# EAGLE design phasor (EAGLE 6.2)
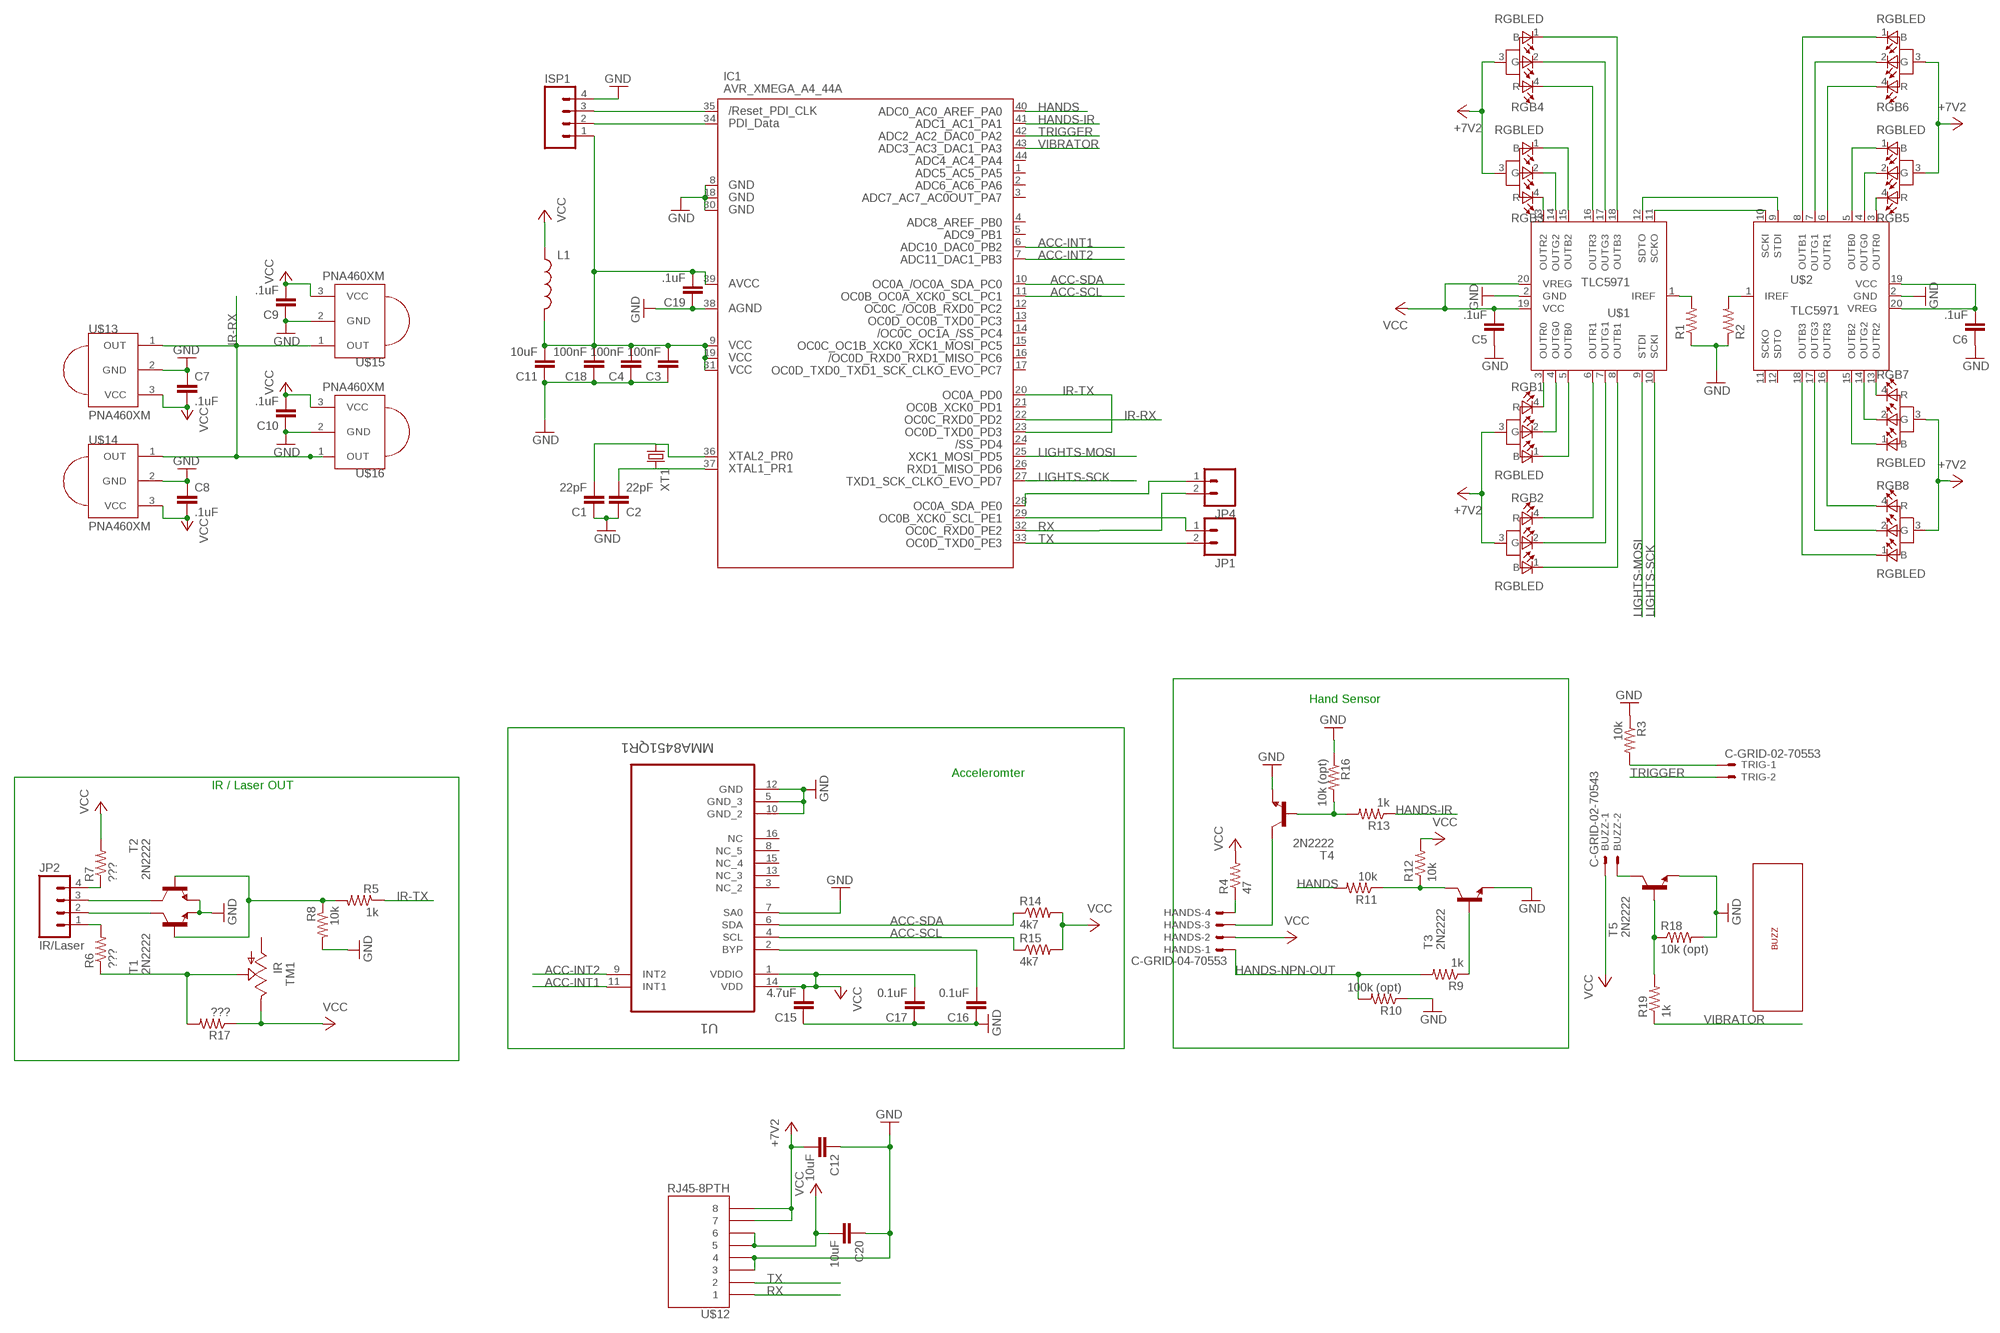
[diagram p0: schematic, sheet 1]

## Parts
BUZZ  C-GRID-02-70543  [70543-02]
C1  22pF  CAPPTH  [CAP-PTH-SMALL]
C2  22pF  CAPPTH  [CAP-PTH-SMALL]
C3  100nF  CAP0603-CAP  [0603-CAP]
C4  100nF  CAP0603-CAP  [0603-CAP]
C5  .1uF  CAPPTH  [CAP-PTH-SMALL]
C6  .1uF  CAPPTH  [CAP-PTH-SMALL]
C7  .1uF  CAPPTH  [CAP-PTH-SMALL]
C8  .1uF  CAPPTH  [CAP-PTH-SMALL]
C9  .1uF  CAPPTH  [CAP-PTH-SMALL]
C10  .1uF  CAPPTH  [CAP-PTH-SMALL]
C11  10uF  CAP1206  [1206]
C12  10uF  CAP1206  [1206]
C15  4.7uF  CAP0805  [0805]
C16  0.1uF  CAP0603-CAP  [0603-CAP]
C17  0.1uF  CAP0603-CAP  [0603-CAP]
C18  100nF  CAP0603-CAP  [0603-CAP]
C19  .1uF  CAP0603-CAP  [0603-CAP]
C20  10uF  CAP1206  [1206]
HANDS  C-GRID-04-70553  [70553-04]
IC1  AVR_XMEGA_A4_44A  [TQFP44]
ISP1  M04LOCK  [1X04_LOCK]
JP1  M02PTH  [1X02]
JP2  IR/Laser  M04LOCK  [1X04_LOCK]
JP4  M02PTH  [1X02]
L1  INDUCTOR1206H*  [1206]
R1  R-US_0204/7  [0204/7]
R2  R-US_0204/7  [0204/7]
R3  10k  R-US_0204/7  [0204/7]
R4  47  R-US_0204/7  [0204/7]
R5  1k  R-US_0204/7  [0204/7]
R6  ???  R-US_0204/7  [0204/7]
R7  ???  R-US_0204/7  [0204/7]
R8  10k  R-US_0204/7  [0204/7]
R9  1k  R-US_0204/7  [0204/7]
R10  100k (opt)  R-US_0204/7  [0204/7]
R11  10k  R-US_0204/7  [0204/7]
R12  10k  R-US_0204/7  [0204/7]
R13  1k  R-US_0204/7  [0204/7]
R14  4k7  R-US_0204/7  [0204/7]
R15  4k7  R-US_0204/7  [0204/7]
R16  10k (opt)  R-US_0204/7  [0204/7]
R17  ???  R-US_0204/7  [0204/7]
R18  10k (opt)  R-US_0204/7  [0204/7]
R19  1k  R-US_0204/7  [0204/7]
RGB1  RGBLED  [RGB-LED-10MM-COMMON-ANODE]
RGB2  RGBLED  [RGB-LED-10MM-COMMON-ANODE]
RGB3  RGBLED  [RGB-LED-10MM-COMMON-ANODE]
RGB4  RGBLED  [RGB-LED-10MM-COMMON-ANODE]
RGB5  RGBLED  [RGB-LED-10MM-COMMON-ANODE]
RGB6  RGBLED  [RGB-LED-10MM-COMMON-ANODE]
RGB7  RGBLED  [RGB-LED-10MM-COMMON-ANODE]
RGB8  RGBLED  [RGB-LED-10MM-COMMON-ANODE]
T1  2N2222  [TO92-EBC-OVAL]
T2  2N2222  [TO92-EBC-OVAL]
T3  2N2222  [TO92-EBC-OVAL]
T4  2N2222  [TO92-EBC-OVAL]
T5  2N2222  [TO92-EBC-OVAL]
TM1  IR  TRIM_US-B25P  [B25P]
TRIG  C-GRID-02-70553  [70553-02]
U1  MMA8451QR1  [QFN50P300X300X100-16N]
U$1  TLC5971  [SSOP20]
U$2  TLC5971  [SSOP20]
U$3  VIB-CAPSULE  [VIB-CAPSULE]
U$12  RJ45-8PTH  [RJ45-8]
U$13  PNA460XM  [PNA460XM]
U$14  PNA460XM  [PNA460XM]
U$15  PNA460XM  [PNA460XM]
U$16  PNA460XM  [PNA460XM]
XT1  CRYSTALHC49US  [HC49US]

## Nets
+7V2: C12.2 RGB1.3(VCC) RGB2.3(VCC) RGB3.3(VCC) RGB4.3(VCC) RGB5.3(VCC) RGB6.3(VCC) RGB7.3(VCC) RGB8.3(VCC) U$12.7 U$12.8
ACC-INT1: IC1.6(PB2) U1.11(INT1)
ACC-INT2: IC1.7(PB3) U1.9(INT2)
ACC-SCL: IC1.11(PC1) R15.1 U1.4(SCL)
ACC-SDA: IC1.10(PC0) R14.1 U1.6(SDA)
GND: C1.1 C2.1 C3.1 C4.1 C5.1 C6.1 C7.1 C8.1 C9.1 C10.1 C11.1 C12.1 C15.1 C16.1 C17.1 C18.1 C19.1 C20.1 IC1.8(GND1) IC1.18(GND2) IC1.30(GND3) IC1.38(AGND) ISP1.4 R1.1 R2.1 R3.1 R8.2 R10.1 R16.1 R18.2 T1.E T2.E T3.E T4.E T5.E U1.5(GND_3) U1.7(SA0) U1.10(GND_2) U1.12(GND) U$1.2(GND) U$2.2(GND) U$12.3 U$12.4 U$13.2(GND) U$14.2(GND) U$15.2(GND) U$16.2(GND)
HANDS: IC1.40(PA0) R11.2
HANDS-IR: IC1.41(PA1) R13.1
HANDS-NPN-OUT: HANDS.1 R9.2 R10.2
IR-RX: IC1.22(PD2) U$13.1(OUT) U$14.1(OUT) U$15.1(OUT) U$16.1(OUT)
IR-TX: IC1.20(PD0) IC1.23(PD3) R5.1
LIGHTS-MOSI: IC1.25(PD5) U$1.9(STDI)
LIGHTS-SCK: IC1.27(PD7) U$1.10(SCKI)
N$1: U$1.11(SCKO) U$2.10(SCKI)
N$2: U$1.12(SDTO) U$2.9(STDI)
N$3: R1.2 U$1.1(IREF)
N$4: RGB1.4(R) U$1.3(OUTR0)
N$5: RGB1.2(G) U$1.4(OUTG0)
N$6: RGB1.1(B) U$1.5(OUTB0)
N$7: RGB2.4(R) U$1.6(OUTR1)
N$8: RGB2.2(G) U$1.7(OUTG1)
N$9: RGB2.1(B) U$1.8(OUTB1)
N$10: RGB3.1(B) U$1.15(OUTB2)
N$11: RGB3.4(R) U$1.13(OUTR2)
N$12: IC1.29(PE1) JP1.1
N$13: RGB4.4(R) U$1.16(OUTR3)
N$14: BUZZ.2 T5.C
N$15: RGB4.1(B) U$1.18(OUTB3)
N$16: RGB5.4(R) U$2.3(OUTR0)
N$17: RGB5.2(G) U$2.4(OUTG0)
N$18: RGB5.1(B) U$2.5(OUTB0)
N$19: R18.1 R19.2 T5.B
N$20: RGB6.2(G) U$2.7(OUTG1)
N$21: RGB6.1(B) U$2.8(OUTB1)
N$22: RGB8.4(R) U$2.16(OUTR3)
N$23: RGB8.2(G) U$2.17(OUTG3)
N$24: RGB8.1(B) U$2.18(OUTB3)
N$25: RGB7.1(B) U$2.15(OUTB2)
N$26: RGB7.2(G) U$2.14(OUTG2)
N$27: RGB7.4(R) U$2.13(OUTR2)
N$28: C2.2 IC1.37(PR1) XT1.2
N$29: C1.2 IC1.36(PR0) XT1.1
N$30: R3.2 TRIG.1
N$31: R6.1 R17.2 TM1.S
N$32: HANDS.4 R4.1
N$33: R9.1 T3.B
N$34: R11.1 R12.1 T3.C
N$35: R2.2 U$2.1(IREF)
N$36: C16.2 U1.2(BYP)
N$37: HANDS.3 T4.C
N$38: JP2.1 R6.2
N$39: JP2.2 T1.C
N$40: JP2.4 R7.1
N$41: JP2.3 T2.C
N$42: R5.2 R8.1 T1.B T2.B
N$43: IC1.28(PE0) JP4.1
N$44: IC1.34(PDI_DATA) ISP1.2
N$45: R13.2 R16.2 T4.B
N$46: IC1.35(RESET) ISP1.3
N$50: C3.2 C4.2 C11.2 C18.2 C19.2 IC1.9(VCC1) IC1.19(VCC2) IC1.31(VCC3) IC1.39(AVCC) ISP1.1 L1.2
RGB3: RGB3.2(G) U$1.14(OUTG2)
RGB4: RGB4.2(G) U$1.17(OUTG3)
RGB6: RGB6.4(R) U$2.6(OUTR1)
RX: IC1.32(PE2) JP4.2 U$12.1
TRIGGER: IC1.42(PA2) TRIG.2
TX: IC1.33(PE3) JP1.2 U$12.2
VCC: BUZZ.1 C5.2 C6.2 C7.2 C8.2 C9.2 C10.2 C15.2 C17.2 C20.2 HANDS.2 L1.1 R4.2 R7.2 R12.2 R14.2 R15.2 R17.1 TM1.E U1.1(VDDIO) U1.14(VDD) U$1.19(VCC) U$1.20(VREG) U$2.19(VCC) U$2.20(VREG) U$12.5 U$12.6 U$13.3(VCC) U$14.3(VCC) U$15.3(VCC) U$16.3(VCC)
VIBRATOR: IC1.43(PA3) R19.1
Unconnected: IC1.1(PA5) IC1.2(PA6) IC1.3(PA7) IC1.4(PB0) IC1.5(PB1) IC1.12(PC2) IC1.13(PC3) IC1.14(PC4) IC1.15(PC5) IC1.16(PC6) IC1.17(PC7) IC1.21(PD1) IC1.24(PD4) IC1.26(PD6) IC1.44(PA4) TM1.A U1.3(NC_2) U1.8(NC_5) U1.13(NC_3) U1.15(NC_4) U1.16(NC) U$2.11(SCKO) U$2.12(SDTO)

## Notes on the sheet
- Hand Sensor
- Acceleromter
- IR / Laser OUT

## Library data of the parts
BUZZ TRIG = con-molex:C-GRID-02: CONNECTOR wire to board 2.54 mm (0.100") pitch header; OC_FARNELL: unknown; OC_NEWARK: unknown
C1-C12 C15-C20 = SparkFun-Passives:CAP: Capacitor Standard 0603 ceramic capacitor, and 0.1" leaded capacitor.
HANDS = con-molex:C-GRID-04: CONNECTOR wire to board 2.54 mm (0.100") pitch header; OC_FARNELL: unknown; OC_NEWARK: unknown
IC1 = xmega:AVR_XMEGA_A4_: Device for Atmel AVR XMEGA A4 Series
ISP1 JP2 = SparkFun-Connectors:M04: Header 4 Standard 4-pin 0.1" header. Use with straight break away headers (SKU : PRT-00116), right angle break away headers (PRT-00553), swiss pins (PRT-00743), machine pins (PRT-00117), and female headers (PRT-00115). Molex polarized connector foot print use with SKU : PRT-08231 with associated crimp pins and housings. 1MM SMD Version SKU: PRT-10208
JP1 JP4 = SparkFun-Connectors:M02: Header 2 Standard 2-pin 0.1" header. Use with straight break away headers (SKU : PRT-00116), right angle break away headers (PRT-00553), swiss pins (PRT-00743), machine pins (PRT-00117), and female headers (PRT-00115). Molex polarized connector foot print use with SKU : PRT-08233 with associated crimp pins and housings.
L1 = greg:INDUCTOR: Inductors Basic Inductor/Choke - 0603 and 1206. Footprints are not proven and vary greatly between part numbers.
R1-R19 = adafruit:R-US_: RESISTOR, American symbol
RGB1-RGB8 = greg:RGBLED
T1-T5 = adafruit:2N2222: NPN TRANSISTOR Big oval pads
TM1 = pot:TRIM_US-: POTENTIOMETER
U1 = greg:MMA8451QR1: 3-Axis, 14-bit/8-bit Digital Accelerometer; MPN: MMA8451QR1; OC_FARNELL: 1908021; OC_NEWARK: 84R7350; PACKAGE: QFN-16; SUPPLIER: Freescale
U$1 U$2 = greg:TLC5971
U$3 = greg:VIB-CAPSULE
U$12 = SparkFun-Connectors:RJ45-8: RJ45 Jack Simple RJ45, 8-pin connection - connector for common Cat5, Cat5e, and Cat6 Ethernet cables. Footprint not yet proven in production. Connector sku is PRT-00643; Breakout PCB sku is BOB-00716.
U$13-U$16 = adafruit:PNA460XM: IR 38KHz receiver PNA4602 and related receivers http://www.ladyada.net/library/pcb/eaglelibrary.html
XT1 = SparkFun-FreqCtrl:CRYSTAL: Various standard crystals. Proven footprints. Spark Fun Electronics SKU : COM-00534

## Board
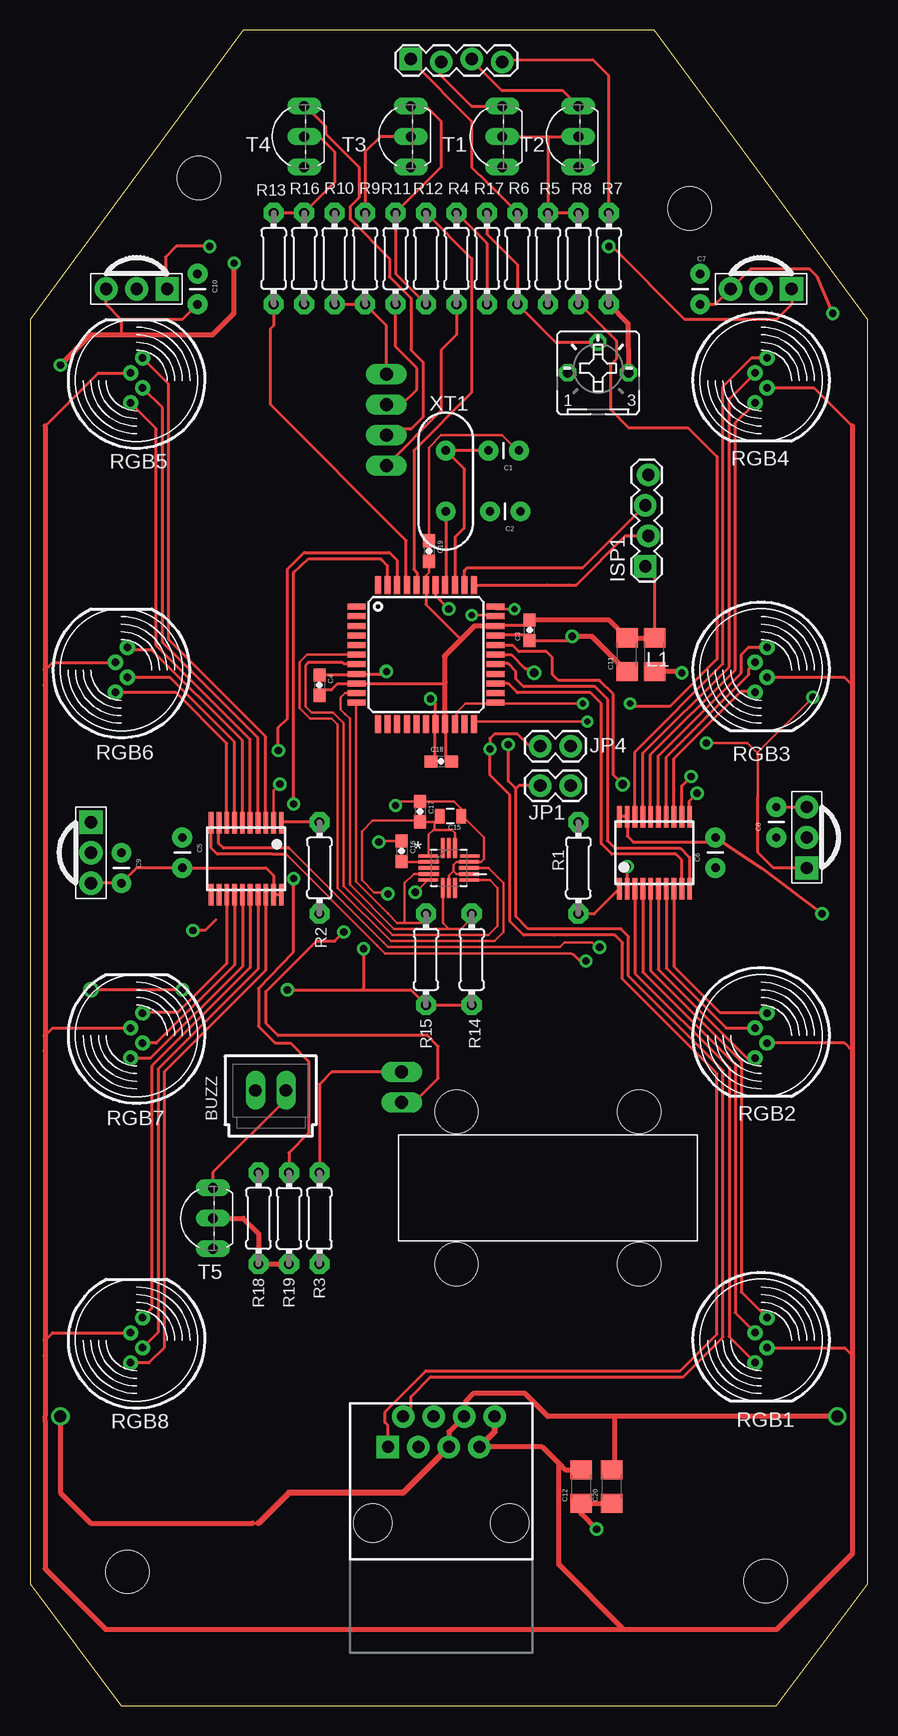
[diagram p1: board, top side]
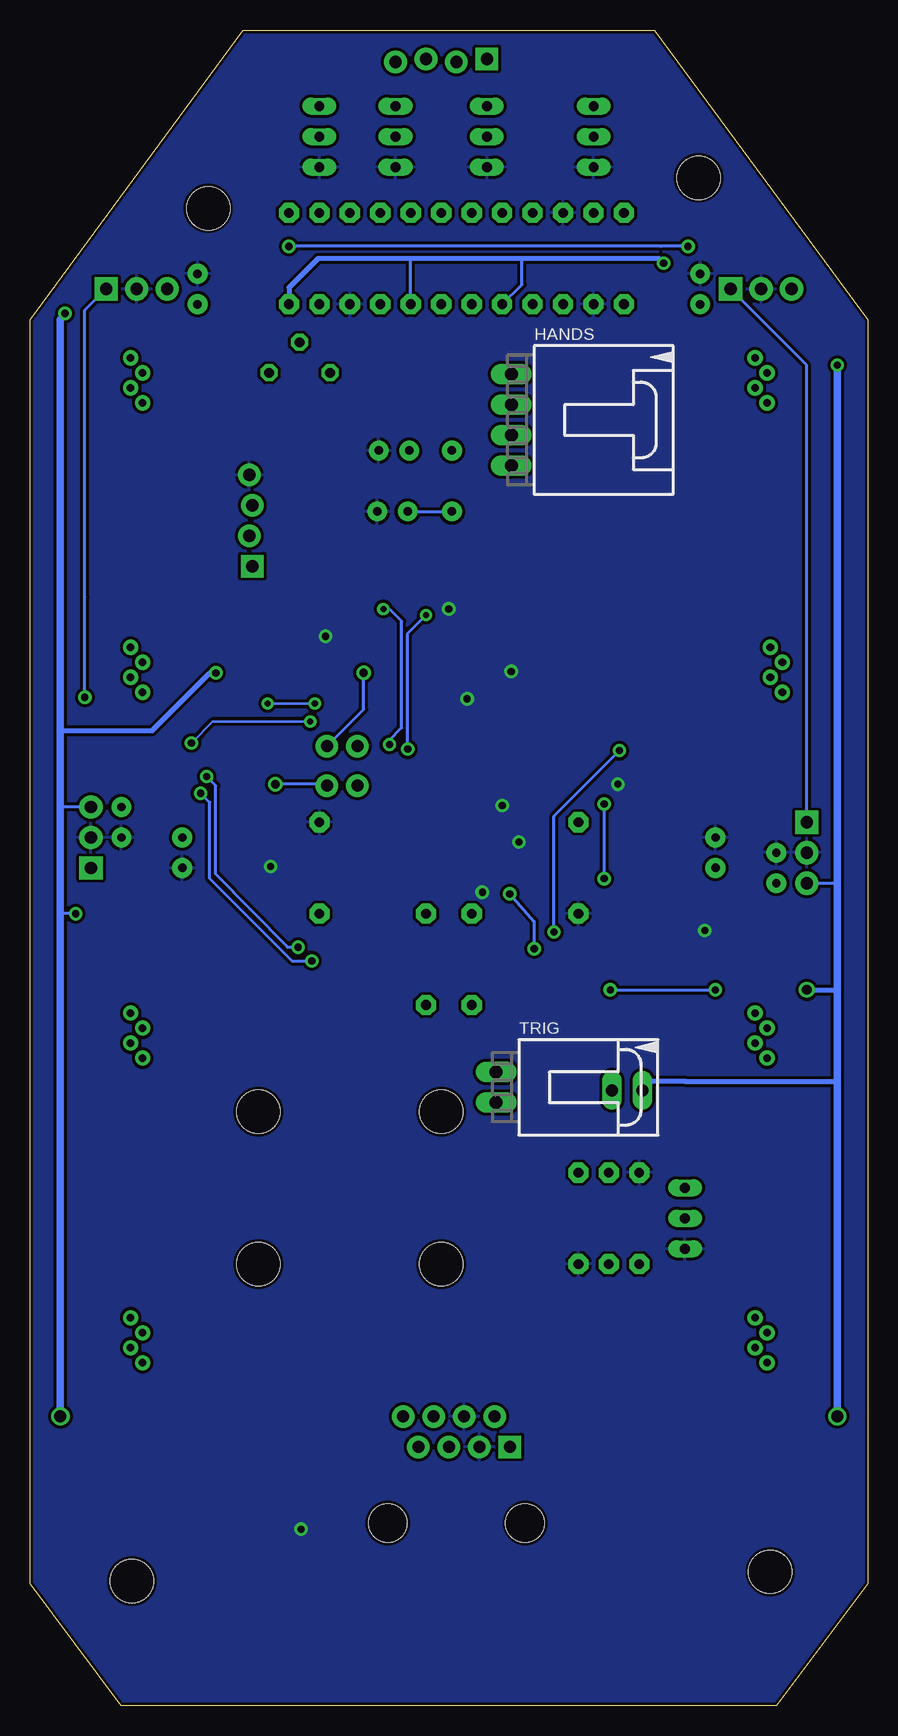
[diagram p2: board, bottom side, seen from below]

Size 69.85 x 139.7 mm. Coordinates in mm from the lower left corner, seen from the top.
Outline: 0,10.16 7.62,0 62.23,0 69.85,10.16 69.85,115.57 52.07,139.7 17.78,139.7 0,115.57 0,10.16
Copper layers (1*16): Top 0.035mm / dielectric 1.5mm / Bottom 0.035mm
Design rules: minimum track width 0.20828125mm, minimum drill 20mil, track to track 8mil, track to pad 8mil, pad to pad 8mil, via to via 8mil, smd to smd 8mil, copper to edge 10mil, drill to drill 8mil, minimum pad ring 12mil, minimum via ring 10mil, stop-mask expansion 4mil, vias tented up to drill 25mil, thermal gap 10mil
Holes 3.6 mm at 8.13,11.18 61.34,10.41 14.1,127.38 54.99,124.84

### Footprints (pad centres in the part's own frame; a part is rotated, then mirrored left to right if it is on the bottom)
70543-02 = drill 1.016 long: 1 -1.27,0; 2 1.27,0
CAP-PTH-SMALL = drill 0.7 pad 1.651: 1 0,0; 2 2.54,0
0603-CAP = smd 1.1 x 1: 1 -0.85,0; 2 0.85,0
1206 = smd 1.6 x 1.8: 1 -1.4,0; 2 1.4,0
0805 = smd 0.8 x 1.2: 1 -0.9,0; 2 0.9,0
70553-04 = drill 1.092 long: 1 -3.81,-7.62; 2 -1.27,-7.62; 3 1.27,-7.62; 4 3.81,-7.62
TQFP44 = smd 1.5 x 0.5: 1 -5.8,4; 2 -5.8,3.2; 3 -5.8,2.4; 4 -5.8,1.6; 5 -5.8,0.8; 6 -5.8,0; 7 -5.8,-0.8; 8 -5.8,-1.6; 9 -5.8,-2.4; 10 -5.8,-3.2; 11 -5.8,-4; 23 5.8,-4; 24 5.8,-3.2; 25 5.8,-2.4; 26 5.8,-1.6; 27 5.8,-0.8; 28 5.8,0; 29 5.8,0.8; 30 5.8,1.6; 31 5.8,2.4; 32 5.8,3.2; 33 5.8,4 | smd 0.5 x 1.5: 12 -4,-5.8; 13 -3.2,-5.8; 14 -2.4,-5.8; 15 -1.6,-5.8; 16 -0.8,-5.8; 17 0,-5.8; 18 0.8,-5.8; 19 1.6,-5.8; 20 2.4,-5.8; 21 3.2,-5.8; 22 4,-5.8; 34 4,5.8; 35 3.2,5.8; 36 2.4,5.8; 37 1.6,5.8; 38 0.8,5.8; 39 0,5.8; 40 -0.8,5.8; 41 -1.6,5.8; 42 -2.4,5.8; 43 -3.2,5.8; 44 -4,5.8
1X04_LOCK = drill 1.016 pad 1.88 square: 1 0,0.127 | drill 1.016 pad 1.88: 2 2.54,-0.127; 3 5.08,0.127; 4 7.62,-0.127
1X02 = drill 1.016 pad 1.88: 1 0,0; 2 2.54,0
0204/7 = drill 0.813 pad 1.676 octagon: 1 -3.81,0; 2 3.81,0
RGB-LED-10MM-COMMON-ANODE = drill 0.635 pad 1.27: 1 -1.875,0.5; 2 -0.625,-0.5; 3 0.625,0.5; 4 1.875,-0.5
TO92-EBC-OVAL = drill 0.813 long: B 0,-1.27; C 2.54,-1.27; E -2.54,-1.27
B25P = drill 0.813 octagon: A -2.54,0; E 2.54,0; S 0,2.54
70553-02 = drill 1.092 long: 1 -1.27,-7.62; 2 1.27,-7.62
QFN50P300X300X100-16N = smd 1.626 x 0.254: 1 -1.727,0.991; 5 -1.727,-0.991; 9 1.702,-0.991; 13 1.727,0.991 | smd 1.676 x 0.305: 2 -1.676,0.508; 3 -1.676,0; 4 -1.676,-0.508; 10 1.676,-0.508; 11 1.676,0; 12 1.676,0.508 | smd 0.305 x 1.676: 6 -0.508,-1.676; 7 0,-1.676; 8 0.508,-1.676; 14 0.508,1.676; 15 0,1.676; 16 -0.508,1.676
SSOP20 = smd 0.4 x 1.8: 1 -2.925,-3; 2 -2.275,-3; 3 -1.625,-3; 4 -0.975,-3; 5 -0.325,-3; 6 0.325,-3; 7 0.975,-3; 8 1.625,-3; 9 2.275,-3; 10 2.925,-3; 11 2.925,3; 12 2.275,3; 13 1.625,3; 14 0.975,3; 15 0.325,3; 16 -0.325,3; 17 -0.975,3; 18 -1.625,3; 19 -2.275,3; 20 -2.925,3
VIB-CAPSULE = hole 3.6: -7.62,6.35; -7.62,-6.35; 7.62,6.35; 7.62,-6.35
RJ45-8 = drill 1 pad 1.88 square: 1 -4.445,6.35 | drill 1 pad 1.88: 2 -3.175,8.89; 3 -1.905,6.35; 4 -0.635,8.89; 5 0.635,6.35; 6 1.905,8.89; 7 3.175,6.35; 8 4.445,8.89 | hole 3.2: -5.715,0; 5.715,0
PNA460XM = drill 1.016 pad 1.93 square: 1 -2.54,0 | drill 1.016 pad 1.93: 2 0,0; 3 2.54,0
HC49US = drill 0.7 pad 1.651: 1 -2.54,0; 2 2.54,0

### Placement (x,y rotation side)
BUZZ  20.07,51.31 0 top
C1  40.77,104.65 180 top
C2  40.89,99.57 180 top
C3  41.66,89.66 90 top
C4  24.13,85.09 270 top
C5  12.7,72.39 270 top
C6  57.15,69.85 90 top
C7  55.88,119.38 270 top
C8  62.23,72.39 90 top
C9  7.62,71.12 270 top
C10  13.97,119.38 270 top
C11  49.78,87.63 90 top
C12  45.97,18.29 90 top
C15  35.05,74.17 180 top
C16  30.99,71.25 270 top
C17  32.51,74.55 270 top
C18  34.29,78.74 0 top
C19  33.27,96.27 270 top
C20  48.51,18.29 90 top
HANDS  22.1,107.19 270 bottom
IC1  33.02,87.63 0 top
ISP1  51.44,95 90 top
JP1  45.09,76.71 180 top
JP2  31.75,137.16 0 top
JP4  45.09,80.01 180 top
L1  52.07,87.63 90 top
R1  45.72,69.85 270 top
R2  24.13,69.85 90 top
R3  24.13,40.64 90 top
R4  35.56,120.65 90 top
R5  45.72,120.65 90 top
R6  40.64,120.65 90 top
R7  48.26,120.65 270 top
R8  43.18,120.65 270 top
R9  27.94,120.65 270 top
R10  25.4,120.65 270 top
R11  33.02,120.65 90 top
R12  30.48,120.65 270 top
R13  20.32,120.65 90 top
R14  36.83,62.23 270 top
R15  33.02,62.23 270 top
R16  22.86,120.65 90 top
R17  38.1,120.65 90 top
R18  19.05,40.64 90 top
R19  21.59,40.64 270 top
RGB1  60.96,30.48 270 top
RGB2  60.96,55.88 270 top
RGB3  60.96,86.36 270 top
RGB4  60.96,110.49 270 top
RGB5  8.89,110.49 90 top
RGB6  7.62,86.36 90 top
RGB7  8.89,55.88 90 top
RGB8  8.89,30.48 90 top
T1  38.1,130.81 90 top
T2  44.45,130.81 90 top
T3  30.48,130.81 90 top
T4  21.59,130.81 90 top
T5  13.97,40.64 90 top
TM1  47.37,111.12 0 top
TRIG  23.37,51.56 270 bottom
U1  34.92,69.85 0 top
U$1  52.07,71.12 0 top
U$2  18.03,70.61 180 top
U$3  43.18,43.18 0 top
U$12  34.29,15.24 0 top
U$13  8.89,118.11 180 top
U$14  5.08,71.12 270 top
U$15  60.96,118.11 180 top
U$16  64.77,72.39 90 top
XT1  34.67,102.11 270 top

### Tracks (layer width: path | path; a pad name or v marks a point on that pad's centre or on a via)
+7V2
  Top 0.254: 68.58,106.68 65.39,109.86 RGB4.3 | 68.58,85.09 67.94,85.73 RGB3.3 | 68.58,54.61 67.94,55.26 RGB2.3 | 68.58,29.21 67.94,29.86 RGB1.3 | 1.27,30.48 1.9,31.11 RGB8.3 | 1.27,106.68 5.71,111.11 RGB5.3 | 1.27,55.88 1.9,56.51 RGB7.3 | 1.27,86.36 1.9,86.98 RGB6.3
  Top 0.406: 68.58,106.68 68.58,85.09 68.58,54.61 68.58,29.21 68.58,12.7 62.23,6.35 49.53,6.35 | 1.27,106.68 1.27,86.36 1.27,85.09 1.27,55.88 1.27,54.61 1.27,30.48 1.27,29.21 1.27,24.13 1.27,23.75 1.27,11.43 6.35,6.35 49.53,6.35 | U$12.7 42.72,21.59 44.09,20.22 | 44.09,20.22 44.62,19.69 C12.2 | 49.53,6.35 44.09,11.79 44.09,20.22
  Top 0.508: U$12.8 38.73,22.86 U$12.7
ACC-INT1
  Top 0.229: 27.43,87.63 IC1.6 23.11,87.63 22.48,87 22.48,83.19 23.37,82.3 25.15,82.3 25.65,81.79 25.65,68.2 30.1,63.75 38.73,63.75 39.5,64.52 39.5,68.58 38.23,69.85 U1.11
ACC-INT2
  Top 0.229: 27.18,86.87 IC1.7 27.05,87 | 36.83,68.83 36.6,68.86 | 36.83,68.83 38.35,68.83 38.99,68.2 38.99,65.02 38.23,64.26 30.35,64.26 30.23,64.26 26.16,68.33 26.16,81.92 25.27,82.8 23.5,82.8 22.99,83.31 22.99,86.74 23.24,87 | 36.83,68.83 U1.9
  Top 0.254: 23.24,87 26.04,87 26.16,86.87 27.18,86.87 IC1.7
ACC-SCL
  Top 0.229: IC1.11 27.18,83.57 27.18,73.41 27.18,68.71 29.84,66.04 30.61,65.28 31.24,65.28 | U1.4 33.02,69.34 32,69.34 31.24,68.58 31.24,66.17 31.24,65.28 | 31.24,65.28 32.64,65.28 33.02,65.66 R15.1
ACC-SDA
  Top 0.229: IC1.10 26.26,84.43 25.91,84.07 25.91,83.06 26.29,82.68 26.67,82.3 26.67,81.28 26.67,68.45 30.35,64.77 34.92,64.77 | R14.1 36.83,65.66 35.94,64.77 34.92,64.77 | U1.6 34.42,65.28 34.92,64.77
GND  (via drill 0.6)
  Top 0.229: 35.31,69.6 35.31,70.1 35.56,70.36 36.58,70.36 U1.12 36.83,70.36 37.59,70.36 37.85,70.61 37.85,72.39 36.07,74.17 C15.1 35.94,74.21 35.94,74.8 35.34,75.4 C17.1 30.82,75.4 v30.48,75.06 | 35.31,69.6 35.56,69.34 36.58,69.34 U1.10 | U1.7 34.92,69.22 35.31,69.6 | U1.5 33.25,68.86 33.27,68.83 U1.5 | U1.5 33.17,68.86 v32.13,67.82 | C16.1 29.17,72.1 v29.08,72.01 | U$2.2 20.31,76.32 v20.83,76.83 | C19.1 33.27,97.28 33.27,104.9 34.29,105.92 39.37,105.92 40.64,104.65 C1.1
  Top 0.254: 15.51,65.54 14.61,64.64 v13.59,64.64 | C4.1 24.13,85.98 27.18,85.98 IC1.8 29.52,86.03 v29.72,86.23 | C18.1 33.53,78.74 33.66,78.74 33.78,78.87 33.78,81.79 IC1.18 33.82,83.53 v33.4,83.95 | 38.77,89.28 IC1.30 38.86,89.28 41.53,89.28 41.66,89.15 41.66,88.9 C3.1 44.87,88.81 v45.21,89.15 45.38,89.32 | IC1.38 33.82,92.55 v34.92,91.44 | U$1.2 49.8,69.97 v49.78,69.98
  Top 0.406: C11.1 46.86,89.15 v45.21,89.15 | C20.1 C12.1 45.97,16 v47.24,14.73
  pour Bottom (isolate 0.254): 17.78,140.21 0,115.57 0,10.16 7.62,0 62.23,0 69.85,10.16 69.85,115.57 52.07,140.21
HANDS
  Top 0.254: R11.2 36.83,120.65 36.83,113.03 36.83,109.47 32,104.65 32,94.74 32.26,94.49 32.26,93.47 IC1.40 32.26,93.47
HANDS-IR
  Top 0.254: R13.1 20.32,115.06 20.07,114.81 20.07,108.46 31.37,97.16 31.37,93.47 IC1.41
HANDS-NPN-OUT
  Top 0.254: R10.2 R9.2 29.72,115.06 HANDS.1
  Top 0.406: R9.2 27.69,116.84
IR-RX  (via drill 0.51, 0.6)
  Top 0.229: v46.48,82.04 37.08,82.04 IC1.22 | 60.71,75.82 60.71,79.38 | 60.71,79.38 60.71,79.5 v65.28,84.07 | v56.39,80.26 59.82,80.26 60.71,79.38
  Top 0.254: U$15.1 63.5,116.84 62.23,115.57 54.61,115.57 48.51,121.67 v48.26,121.67 | U$16.1 61.98,69.85 60.71,71.12 60.71,75.82 | v14.99,121.67 12.19,121.67 11.3,120.78 11.3,118.24 U$13.1
  Bottom 0.229: v46.48,82.04 54.61,82.04 v56.39,80.26
  Bottom 0.254: v14.99,121.67 17.27,121.67 v48.26,121.67 | v65.28,84.07 65.28,92.46 65.28,116.33 U$15.1 | U$14.1 5.08,74.93 5.08,76.2 5.08,111.76 U$13.1
IR-TX  (via drill 0.51)
  Top 0.229: IC1.20 35.56,82.04 35.56,82.8 36.32,83.57 38.61,83.57 IC1.23 38.86,83.57 v46.1,83.57
  Top 0.254: R5.1 45.85,116.84 48.9,113.79 48.9,112.27 48.39,111.76 48.39,108.08 49.91,106.55 54.86,106.55 57.28,104.14 57.28,87.25 53.34,83.31 50.29,83.31 v50.04,83.57 | 38.73,83.69 IC1.23
  Bottom 0.229: v50.04,83.57 v46.1,83.57
LIGHTS-MOSI
  Top 0.229: 38.86,85.09 IC1.25
  Top 0.254: U$1.9 54.34,70.5 53.85,70.99 48.51,70.99 47.62,71.88 47.62,83.57 46.74,84.45 40.64,84.45 39.88,85.22 38.83,85.22 IC1.25 38.93,85.34
LIGHTS-SCK
  Top 0.254: 38.91,86.74 IC1.27 38.86,86.87 39.88,86.87 40.51,86.23 40.51,85.6 41.15,84.96 47.12,84.96 48.13,83.95 48.13,72.14 48.77,71.5 54.23,71.5 54.99,70.74 U$1.10
N$1  (via drill 0.6)
  Top 0.229: 21.34,70.99 28.96,63.37 29.59,62.74 45.09,62.74 45.34,62.61
  Top 0.254: U$1.11 54.99,75.44 v55.63,76.07 | U$2.10 15.11,71.5 15.62,70.99 20.19,70.99 21.34,70.99 | 45.34,62.61 45.85,62.1 v46.35,62.1
  Bottom 0.254: v55.63,76.07 54.86,75.31 54.86,68.96 48.26,62.36 48.01,62.1 v46.35,62.1
N$2  (via drill 0.6)
  Top 0.229: 21.59,71.5 29.46,63.63 29.84,63.25 44.2,63.25 44.58,63.63 46.86,63.63 47.24,63.25
  Top 0.254: U$1.12 54.34,76.7 v55.12,77.47 | 21.59,71.5 16.13,71.5 15.75,71.88 15.75,73.6 U$2.9 | 47.24,63.25 v47.5,63.25
  Bottom 0.254: v55.12,77.47 54.36,76.71 54.36,69.34 48.39,63.25 v47.5,63.25
N$3
  Top 0.254: R1.2 47.06,66.04 U$1.1
N$4
  Top 0.254: U$1.3 50.45,61.06 58.29,53.21 58.29,30.77 RGB1.4
N$5
  Top 0.254: U$1.4 51.09,61.17 58.8,53.47 58.8,32.76 RGB1.2
N$6
  Top 0.254: U$1.5 51.74,61.28 59.31,53.72 59.31,34.51 RGB1.1
N$7
  Top 0.254: U$1.6 52.4,61.4 59.31,54.48 59.79,54.01 RGB2.4
N$8
  Top 0.254: U$1.7 53.05,61.51 58.05,56.51 RGB2.2
N$9
  Top 0.254: U$1.8 53.7,61.62 57.53,57.78 61.43,57.78 RGB2.1
N$10
  Top 0.254: U$1.15 52.4,79.19 59.31,86.11 59.31,87.63 59.94,88.27 61.43,88.27 RGB3.1
N$11
  Top 0.254: U$1.13 53.7,78.97 59.31,84.58 60.36,84.58 RGB3.4
N$12  (via drill 0.7)
  Top 0.254: v49.4,76.83 48.64,77.6 48.64,84.33 47.5,85.47 44.07,85.47 43.56,85.98 43.56,87.12 43.56,87.38 43.05,87.88 40.77,87.88 40.26,88.39 38.86,88.39 IC1.29
  Bottom 0.254: JP1.1 45.21,76.83 v49.4,76.83
N$13
  Top 0.254: U$1.16 51.74,79.3 58.8,86.36 58.8,106.96 RGB4.4
N$14
  Top 0.254: BUZZ.2 21.34,50.55 15.24,44.45 T5.C
N$15
  Top 0.254: U$1.18 50.45,79.53 57.78,86.87 57.78,109.98 60.2,112.39 61.43,112.39 RGB4.1
N$16
  Top 0.254: U$2.3 19.66,80.8 11.56,88.9 11.56,110.2 RGB5.4
N$17
  Top 0.254: U$2.4 19.01,80.69 11.05,88.65 11.05,108.21 RGB5.2
N$18
  Top 0.254: U$2.5 18.36,80.57 10.54,88.39 10.54,106.46 RGB5.1
N$19
  Top 0.406: T5.B 17.78,40.64 19.05,39.37 19.05,37.47 R18.1 21.46,36.83 R19.2
N$20
  Top 0.254: U$2.7 17.06,80.35 11.68,85.72 RGB6.2
N$21
  Top 0.254: U$2.8 16.41,80.24 12.19,84.45 7.15,84.45 RGB6.1
N$22
  Top 0.254: U$2.16 18.36,61.54 10.16,53.34 10.16,33.12 RGB8.4
N$23
  Top 0.254: U$2.17 19.01,61.43 10.67,53.09 10.67,31.13 RGB8.2
N$24
  Top 0.254: U$2.18 19.66,61.31 11.18,52.83 11.18,29.84 9.91,28.57 8.42,28.57 RGB8.1
N$25
  Top 0.254: U$2.15 17.71,61.65 10.03,53.98 8.42,53.98 RGB7.1
N$26
  Top 0.254: U$2.14 17.06,61.76 10.54,55.24 9.4,55.24 RGB7.2
N$27
  Top 0.254: U$2.13 16.41,61.88 12.32,57.78 9.42,57.78 RGB7.4
N$28
  Top 0.254: XT1.2 34.67,93.47 IC1.37
  Bottom 0.254: C2.2 XT1.2
N$29
  Top 0.254: C1.2 XT1.1 36.2,103.12 36.2,98.17 35.43,97.41 35.43,93.47 IC1.36
N$30
  Top 0.254: TRIG.1 25.15,52.83 24.13,51.82 R3.2
N$31
  Top 0.254: R17.2 38.1,122.68 40.64,120.14 R6.1 43.81,113.67 TM1.S
N$32
  Top 0.254: R4.1 35.56,114.3 34.29,113.03 34.29,107.95 HANDS.4
N$33
  Top 0.254: T3.B 29.21,130.81 27.94,129.54 R9.1
N$34
  Top 0.254: R11.1 30.48,119.38 R12.1 34.29,128.27 34.29,132.08 33.02,133.35 T3.C
N$35
  Top 0.254: R2.2 21.01,73.66 U$2.1
N$36
  Top 0.229: U1.2 31.75,70.36 31.08,70.36 C16.2
N$37
  Top 0.254: T4.C 22.99,133.35 24.64,131.7 24.64,131.06 27.43,128.27 27.43,125.73 26.67,124.97 26.67,123.95 29.97,120.65 29.97,119.13 31.75,117.35 31.75,116.33 31.75,113.03 32.77,112.01 32.77,107.44 31.75,106.43 30.23,106.43 HANDS.3
N$38
  Top 0.254: JP2.1 31.75,137.16 36.83,132.08 36.83,128.27 38.1,127 R6.2
N$39
  Top 0.229: 34.29,135.89 34.29,136.91 JP2.2
  Top 0.254: 34.16,137.03 34.16,136.02 34.29,135.89 36.83,133.35 T1.C
N$40
  Top 0.254: R7.1 48.26,125.73 48.26,135.89 46.99,137.16 39.5,137.16 JP2.4
N$41
  Top 0.254: 36.83,137.16 JP2.3 36.83,137.16 | T2.C 44.45,134.62 39.37,134.62 36.83,137.16
N$42
  Top 0.254: R5.2 R8.1 43.18,130.81 | T2.B 44.45,130.81 43.18,130.81 | T1.B 43.18,130.81
N$43  (via drill 0.7)
  Top 0.254: IC1.28 40.13,87.63 41.27,86.49 41.66,86.49 v42.04,86.11
  Bottom 0.254: JP4.1 42.04,83.06 v42.04,86.11
N$44
  Top 0.254: IC1.34 43.14,93.43 44.92,93.43 45.55,93.43 49.66,97.54 ISP1.2
N$45
  Top 0.254: R13.2 R16.2 25.4,127 25.4,129.54 24.13,130.81 T4.B
N$46
  Top 0.254: IC1.35 36.22,94.64 36.45,94.87 40.89,94.87 46.1,94.87 ISP1.3
N$50
  Top 0.229: C19.2 33.27,95.25 33.27,94.49 33.02,94.23 33.02,93.47 IC1.39
  Top 0.254: C4.2 24.13,84.33 24.13,84.58 24.26,84.71 25.15,84.71 25.65,85.22 27.18,85.22 IC1.9 34.51,85.23 34.62,85.34 | IC1.31 38.86,90.04 41.53,90.04 41.66,90.17 41.66,90.42 C3.2 | IC1.19 34.67,81.79 34.67,78.87 34.8,78.74 35.05,78.74 C18.2 | IC1.39 33.02,91.82 35.94,88.9 | ISP1.1 52.07,94.23 L1.2
  Top 0.406: IC1.31 37.07,90.03 35.94,88.9 34.54,87.5 34.62,87.43 34.62,85.34 IC1.19 | C3.2 48.3,90.51 C11.2 L1.2
RGB3
  Top 0.254: U$1.14 53.05,79.08 59.94,85.98 59.94,86.47 RGB3.2
RGB4
  Top 0.254: U$1.17 51.09,79.42 58.29,86.61 58.29,108.95 RGB4.2
RGB6
  Top 0.254: U$2.6 17.71,80.46 10.16,88.01 8.34,88.01 RGB6.4
RX  (via drill 0.51, 0.6)
  Top 0.229: v36.83,90.93 38.61,90.93 IC1.32
  Top 0.254: U$12.1 29.84,23.37 29.59,23.62 29.59,24.51 33.02,27.94 54.23,27.94 57.28,30.99 57.28,52.7 49.4,60.58 49.4,63.5 49.4,63.63 48.77,64.26 44.7,64.26 43.69,64.26 41.15,64.26 40.01,65.41 40.01,75.95 38.35,77.6 v38.35,79.76 38.35,80.64 38.73,81.03 40.64,81.03 41.66,80.01 JP4.2
  Bottom 0.254: v38.35,79.76 38.35,89.41 v36.83,90.93
TRIGGER  (via drill 0.6)
  Top 0.254: v20.7,79.63 20.7,81.53 21.46,82.3 21.46,94.74 22.86,96.14 29.97,96.14 30.61,95.5 30.61,93.44 IC1.42 | v26.16,64.52 25.4,63.75 23.88,63.75 19.68,59.56 19.68,56.9 20.7,55.88 33.15,55.88 34.04,54.99 34.04,52.32 32,50.29 TRIG.2
  Bottom 0.254: v26.16,64.52 26.16,74.17 v20.7,79.63
TX  (via drill 0.51, 0.6)
  Top 0.229: v40.39,91.44 38.86,91.44 IC1.33
  Top 0.254: U$12.2 31.75,24.77 31.75,25.78 33.4,27.43 54.48,27.43 57.78,30.73 57.78,52.96 49.91,60.83 49.91,64.14 49.28,64.77 43.94,64.77 41.53,64.77 40.51,65.79 40.51,76.45 | 40.51,76.45 39.88,77.09 v39.88,80.14 | JP1.2 40.77,76.71 40.51,76.45
  Bottom 0.254: v39.88,80.14 39.88,80.52 38.86,81.53 38.86,90.42 39.88,91.44 v40.39,91.44
VCC  (via drill 0.6, 0.8, 1)
  Top 0.229: 33.25,70.84 33.25,70.87 | 33.25,70.87 33.25,72.62 33.66,73.03 33.78,73.03 | 33.78,73.03 35.18,73.03 35.43,72.77 U1.14 | 29.72,67.82 v29.84,67.69 29.72,67.82 | 33.73,73.7 C17.2 32.42,73.79 28.57,73.79 27.69,72.9 27.69,68.83 28.7,67.82 29.72,67.82 | 33.73,73.7 C15.2 | 33.73,73.7 33.73,73.07 33.78,73.03 | U1.1 33.27,70.87 33.25,70.87 | 19.05,15.24 18.54,15.24
  Top 0.254: 7.62,115.57 12.7,115.57 C10.2 | 7.62,115.57 6.35,116.84 U$13.3 | C7.2 57.15,116.84 U$15.3 59.69,119.38 60.07,119.76 65.02,119.76 65.66,119.13 v66.93,116.08 | U$14.3 C9.2 8.89,69.85 C5.2 19.68,69.85 20.32,69.22 20.32,67.62 | C8.2 U$16.3 | v66.04,66.04 60.96,69.85 C6.2 56.77,72.01 50.29,72.01 49.8,72.51 U$1.19 U$1.20 | R14.2 R15.2 31.75,59.69 27.69,59.69 | v12.7,59.69 v5.08,59.69 | R4.2 38.1,121.92 R17.1 | 20.32,67.62 U$2.19 | 20.32,67.62 20.95,67.62 U$2.20 | 7.62,115.57 7.62,114.3 | v21.46,59.69 27.69,59.69 | v27.81,63.12 27.81,59.82 27.69,59.69 | 30.48,116.59 R12.2 30.48,113.28 32.26,111.51 32.26,109.73 30.99,108.46 HANDS.2
  Top 0.406: R7.2 49.87,115.23 TM1.E | v2.54,111.76 5.08,114.3 5.46,114.3 7.62,114.3 15.24,114.3 17.02,116.08 v17.02,120.27 | v2.54,24.13 2.54,17.78 5.08,15.24 18.54,15.24 18.59,15.24 | U$12.5 34.92,22.86 U$12.6 36.32,24.26 36.32,25.4 36.96,26.04 41.27,26.04 43.18,24.13 48.77,24.13 | v67.31,24.13 48.77,24.13 | v54.36,86.11 54.23,86.23 L1.1 | C20.2 48.77,19.94 48.77,24.13
  Top 0.508: U$12.5 31.11,17.78 21.59,17.78 19.05,15.24
  Bottom 0.254: U$14.3 2.54,68.58 | U$16.3 67.31,74.93 | v66.04,66.04 67.31,66.04 | v21.46,59.69 v12.7,59.69 | v66.93,116.08 67.31,115.57 | R12.2 28.83,118.49 28.83,120.65 | R17.1 38.1,120.52 37.97,120.65 | v29.84,67.69 27.81,65.41 v27.81,63.12
  Bottom 0.406: v5.08,59.69 2.54,59.69 | R7.2 48.26,118.24 45.85,120.65 37.97,120.65 28.83,120.65 19.81,120.65 17.4,120.65 v17.02,120.27 | 67.31,81.28 59.69,81.28 54.86,86.11 v54.36,86.11 | 2.54,52.07 15.24,52.07 18.03,52.07 BUZZ.1
  Bottom 0.635: v67.31,24.13 67.31,66.04 67.31,74.93 67.31,81.28 67.31,115.57 | v2.54,24.13 2.54,50.8 2.54,52.07 2.54,59.69 2.54,68.58 2.54,72.39 2.54,77.47 2.54,99.06 2.54,110.49 v2.54,111.76
VIBRATOR  (via drill 0.6)
  Top 0.254: IC1.43 29.82,95.02 29.34,95.5 | 29.34,95.5 29.21,95.63 | v21.97,68.96 21.97,62.87 19.05,59.82 19.05,56.64 20.45,55.24 21.72,55.24 23.24,53.72 23.24,47.75 21.59,46.1 R19.1 | v21.97,75.18 21.97,94.49 23.24,95.63 29.21,95.63 | 29.21,95.63 29.34,95.5
  Bottom 0.254: v21.97,68.96 v21.97,75.18